# Altium project Motor_Driver.PrjPcb
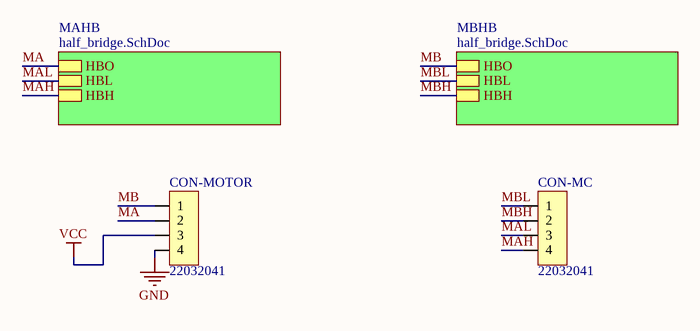
[diagram p0: Motor_Driver.SchDoc]
2 sheets, 20 parts. Net scope: hierarchical (ports join the sheet entries above them; power ports are global).
Board file: Motor_Driver_PCB.PcbDoc
Sheets:
  Motor_Driver.SchDoc
    MBHB = Half_Bridge.SchDoc
    MAHB = Half_Bridge.SchDoc

## Sheet Motor_Driver.SchDoc
size A4; Organization1: VINCULADA AO EXÉRCITO BRASILEIRO; Organization2: FÁBRICA DE MATERIAL DE; Organization3: COMUNICAÇÕES E ELETRÔNICA; Organization0: INDÚSTRIA DE MATERIAL BÉLICO DO BRASIL

### Parts
CON-MC  22032041  [04x01_Conector_Male]
CON-MOTOR  22032041  [04x01_Conector_Male]

### Sub-sheets
MAHB = half_bridge.SchDoc: HBO, HBL, HBH
MBHB = half_bridge.SchDoc: HBO, HBL, HBH

### Nets
GND: CON-MOTOR.4
VCC: CON-MOTOR.3
MA: CON-MOTOR.2 ; sheet MAHB/HBO
MAH: CON-MC.4 ; sheet MAHB/HBH
MAL: CON-MC.3 ; sheet MAHB/HBL
MB: CON-MOTOR.1 ; sheet MBHB/HBO  [project net MA]
MBH: CON-MC.2 ; sheet MBHB/HBH
MBL: CON-MC.1 ; sheet MBHB/HBL

### Notes on the sheet
- USADO EQUIP.:
- DATA:
- ENG:
- HORA:
- APROV._______
- REV:
- TÍTULO:
- FOLHA:
- /
- FORMATO:
- A4
- CÓDIGO:
- ESTOQUE:

### Library data of the parts
CON-MC CON-MOTOR = 04x01_Conector_Male-SCH: CONN HEADER 4POS .100 VERT TIN

## Sheet Half_Bridge.SchDoc
size A3; Organization0: INDÚSTRIA DE MATERIAL BÉLICO DO BRASIL; Organization2: FÁBRICA DE MATERIAL DE; Organization3: COMUNICAÇÕES E ELETRÔNICA; Organization1: VINCULADA AO EXÉRCITO BRASILEIRO; USADOEQP: USADOEQP; Esquematico: Esquemático; CODIGO: Código; ESTOQUE: Estoque
Used 2 times, as channels MBHB, MAHB. Parts and nets are listed once, with the designators drawn on the sheet.
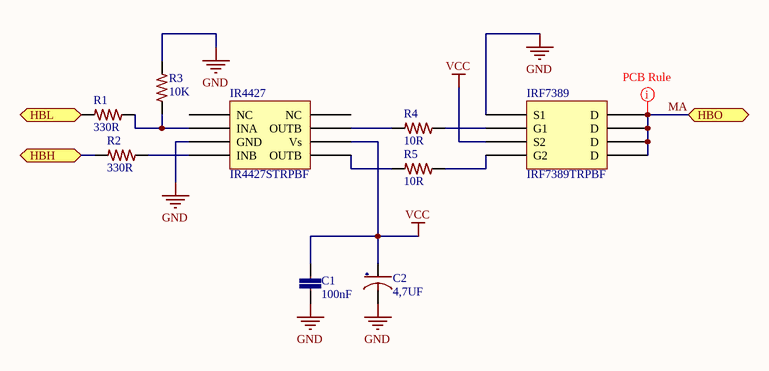
[diagram p1: Half_Bridge.SchDoc]

### Parts
C1  100nF  [0402-CAP]
C2  4,7UF  [PCBComponent]
IR4427  IR4427STRPBF  [IR4427-PCB]
IRF7389  IRF7389TRPBF  [IRF7389-PCB]
R1  330R  [0402-RES-HD]
R2  330R  [0402-RES-HD]
R3  10K  [0402-RES-HD]
R4  10R  [0402-RES-HD]
R5  10R  [0402-RES-HD]

### Ports
HBH, HBL, HBO

### Nets
GND: C1.2 C2.2(-) IR4427.3(GND) IRF7389.1(S1) R3.1
VCC: C1.1 C2.1(+) IR4427.6(Vs) IRF7389.3(S2)
HBH: R2.1 ; port HBH
HBL: R1.1 ; port HBL
MA: IRF7389.5(D) IRF7389.6(D) IRF7389.7(D) IRF7389.8(D) ; port HBO
NetIR4427_2: IR4427.2(INA) R1.2 R3.2
NetIR4427_4: IR4427.4(INB) R2.2
NetIR4427_5: IR4427.5(OUTB) R5.1
NetIR4427_7: IR4427.7(OUTB) R4.1
NetIRF7389_2: IRF7389.2(G1) R4.2
NetIRF7389_4: IRF7389.4(G2) R5.2

Not connected (* = marked no-connect by the designer): IR4427 1(NC) 8(NC)

### Channels
MBHB: designators end in _MBHB; ports HBH=MBH HBL=MBL HBO=MA
MAHB: designators end in _MAHB; ports HBH=MAH HBL=MAL HBO=MA

### Layout directives
rule Polygon Connect Style [Style - Direct Connect]: MA

### Notes on the sheet
- USADO EQUIP.:
- ENG:
- REV:
- TÍTULO:
- DATA:
- HORA:
- APROV._______
- CÓDIGO:
- ESTOQUE:
- FOLHA:
- /
- FORMATO:
- A3

### Library data of the parts
C1 = CC0402-100pF-A.2: CAP CER 100PF 50V 1% NP0 0402; Part No: GRM1555C1H101FA01D; Cod EMS: 05.281.019.520; Value: 100p
C2 = TPSD106K035R0300-01.A.1: Tantalum Capacitors - Solid SMD 10uF 35V 10% L ESR; Rule: UNIONINDEX{}0[]RULEKIND{}PolygonConnect[]NETSCOPE{}AnyNet[]LAYERKIND{}SameLayer[]NAME{}Schematic Polygon Connect Style[]CONNECTSTYLE{}Direct[]RELIEFCONDUCTORWIDTH{}10mil[]RELIEFENTRIES{}4[]POLYGONRELIEFANGLE{}45 Angle[]AIRGAPWIDTH{}10mil[]UNIT{}Imperial[]PcbType{}ProtelPcb
IR4427 = IR4427: IC DRIVER DUAL LOW SIDE 8-DIP
IRF7389 = IRF7389: MOSFET N/P-CH 30V 8-SOIC
R1 R2 = R0402-330R-7: RES 330 OHM 1/10W 1% 0402 SMD; Part No: ERJ-2RKF3300X; Cod EMS: 05.280.029.506; Value: 330; Family Description: RESISTOR FILME ESPESSO 10R-1M / 1/10W / 1% / 0402. P/N: ERJ-2RKF....X – PANASONIC ELECTRONIC COMPONENTS.; Family: ERJ-2RKF....X
R3 = R0402-10K-10: RES 10K OHM 1/10W 1% 0402 SMD; Part No: ERJ-2RKF1002X; Cod EMS: 05.280.029.525; Family Description: RESISTOR FILME ESPESSO 10R-1M / 1/10W / 1% / 0402. P/N: ERJ-2RKF....X – PANASONIC ELECTRONIC COMPONENTS.; Value: 10K; Family: ERJ-2RKF....X
R4 R5 = R0402-10R-6: RES 10 OHM 1/10W 1% 0402 SMD; Part No: ERJ-2RKF10R0X; Cod EMS: 05.280.029.523; Value: 10; Family Description: RESISTOR FILME ESPESSO 10R-1M / 1/10W / 1% / 0402. P/N: ERJ-2RKF....X – PANASONIC ELECTRONIC COMPONENTS.; Family: ERJ-2RKF....X

## Nets that join several sheets
GND: Motor_Driver (CON-MOTOR.4), MBHB (5 pins), MAHB (5 pins)
VCC: Motor_Driver (CON-MOTOR.3), MBHB (C1_MBHB.1 C2_MBHB.1 IR4427_MBHB.6 IRF7389_MBHB.3), MAHB (C1_MAHB.1 C2_MAHB.1 IR4427_MAHB.6 IRF7389_MAHB.3)
MA: Motor_Driver (CON-MOTOR.2), MAHB (IRF7389_MAHB.5 IRF7389_MAHB.6 IRF7389_MAHB.7 IRF7389_MAHB.8)
MA: Motor_Driver (CON-MOTOR.1), MBHB (IRF7389_MBHB.5 IRF7389_MBHB.6 IRF7389_MBHB.7 IRF7389_MBHB.8)
MAH: Motor_Driver (CON-MC.4), MAHB (R2_MAHB.1)
MAL: Motor_Driver (CON-MC.3), MAHB (R1_MAHB.1)
MBH: Motor_Driver (CON-MC.2), MBHB (R2_MBHB.1)
MBL: Motor_Driver (CON-MC.1), MBHB (R1_MBHB.1)